# EAGLE design HumidityMetter_v2 (EAGLE 6.1)
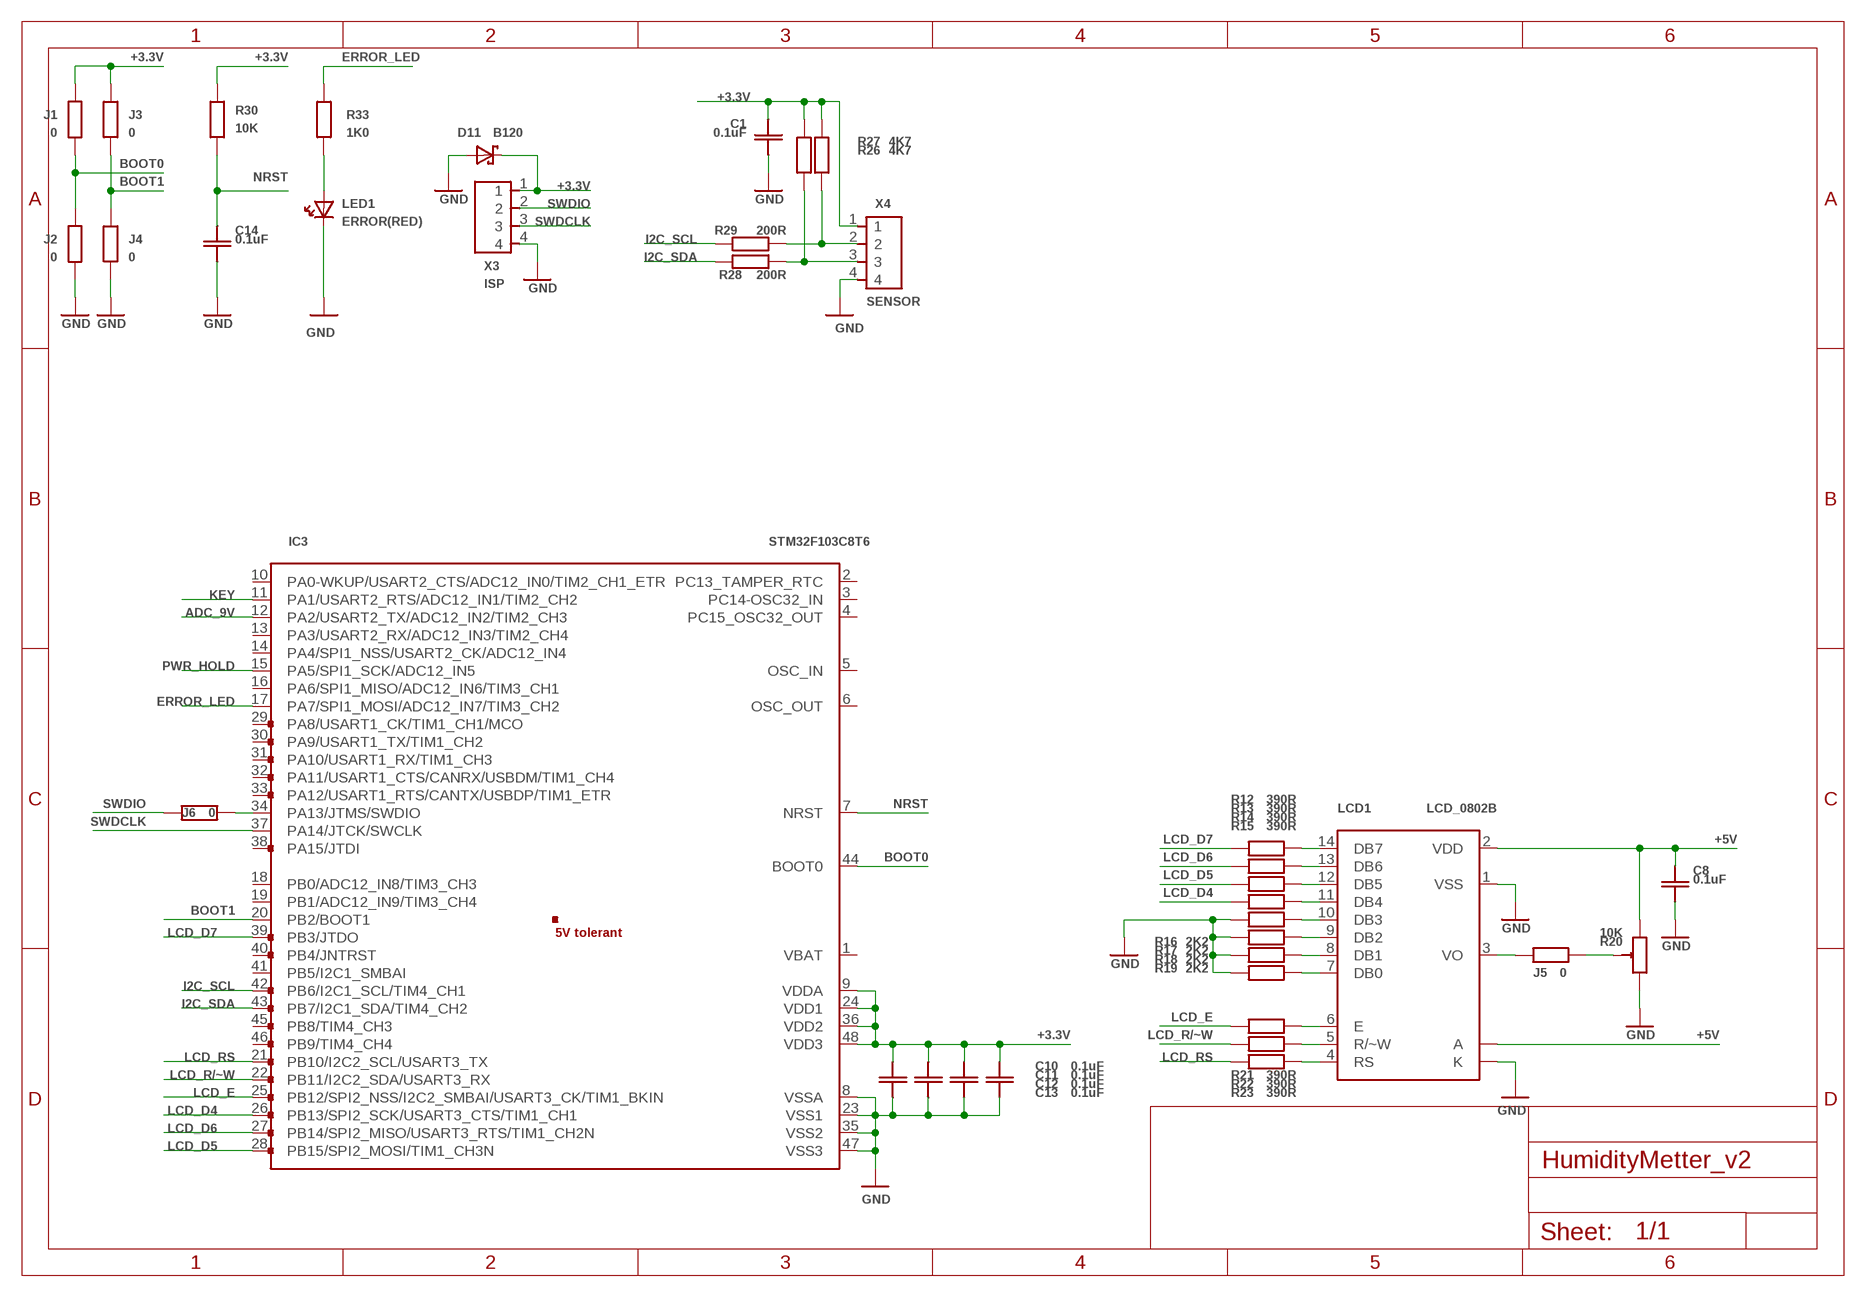
[diagram p0: schematic, sheet 1, part 1 of 2]
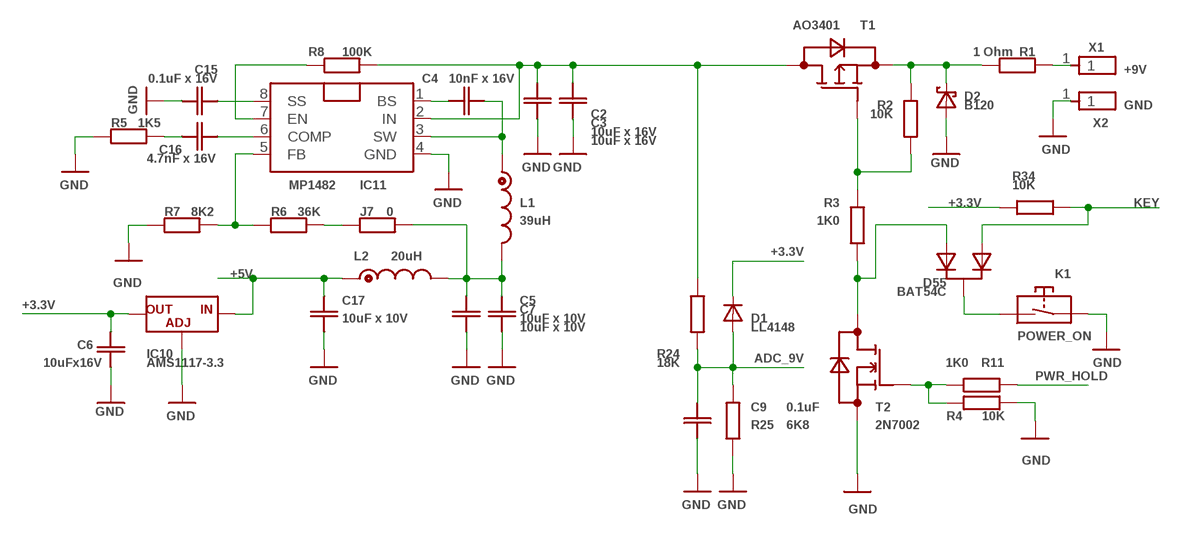
[diagram p1: schematic, sheet 1, part 2 of 2]

## Parts
C1  0.1uF  CSMD_0603  [RSMD_0603]
C2  10uF x 16V  CSMD_1206  [RSMD_1206]
C3  10uF x 16V  CSMD_1206  [RSMD_1206]
C4  10nF x 16V  CSMD_0603  [RSMD_0603]
C5  10uF x 10V  CSMD_1206  [RSMD_1206]
C6  10uFx16V  CSMD_1206  [RSMD_1206]
C7  10uF x 10V  CSMD_1206  [RSMD_1206]
C8  0.1uF  CSMD_0603  [RSMD_0603]
C9  0.1uF  CSMD_0603  [RSMD_0603]
C10  0.1uF  CSMD_0603  [RSMD_0603]
C11  0.1uF  CSMD_0603  [RSMD_0603]
C12  0.1uF  CSMD_0603  [RSMD_0603]
C13  0.1uF  CSMD_0603  [RSMD_0603]
C14  0.1uF  CSMD_0603  [RSMD_0603]
C15  0.1uF x 16V  CSMD_0603  [RSMD_0603]
C16  4.7nF x 16V  CSMD_0603  [RSMD_0603]
C17  10uF x 10V  CSMD_1206  [RSMD_1206]
D1  LL4148  LL4147SOD-80  [SOD-80]
D2  B120  B120(DO-214AC)  [DO-214AC]
D11  B120  B120(DO-214AC)  [DO-214AC]
D55  BAT54C  BAT54C(SOT23)  [SOT23_SMALL_PADS]
IC3  STM32F103C8T6  STM32F103C8T6(LQFP48)(LQFP48)  [LQFP48]
IC10  AMS1117-3.3  AMS1117SOT223_WS  [SOT223(WAVE_SOLDERING)]
IC11  MP1482  MP1482(SO-8)  [SOIC8]
J1  0  RSMD_0603  [RSMD_0603]
J2  0  RSMD_0603  [RSMD_0603]
J3  0  RSMD_0603  [RSMD_0603]
J4  0  RSMD_0603  [RSMD_0603]
J5  0  RSMD_1206_BIG_GAP  [RSMD_1206_BIG_GAP]
J6  0  RSMD_0805  [RSMD_0805]
J7  0  RSMD_1206_BIG_GAP  [RSMD_1206_BIG_GAP]
K1  POWER_ON  KEY(7X4.5)  [KEY_7X4.5]
L1  39uH  L(7MM)  [COIL_7MM]
L2  20uH  L(1206)  [RSMD_1206]
LCD1  LCD_0802B  LCD_0802BLCD_0802B_2SCREW(CHINA_CLONE)  [LCD_0802B_2SCREW(CHINA_CLONE)]
LED1  ERROR(RED)  LED3MM(SMD0805)  [LED_0805]
R1  1 Ohm  RSMD_1206  [RSMD_1206]
R2  10K  RSMD_0603  [RSMD_0603]
R3  1K0  RSMD_0603  [RSMD_0603]
R4  10K  RSMD_0603  [RSMD_0603]
R5  1K5  RSMD_0603  [RSMD_0603]
R6  36K  RSMD_0603  [RSMD_0603]
R7  8K2  RSMD_0603  [RSMD_0603]
R8  100K  RSMD_0603  [RSMD_0603]
R11  1K0  RSMD_0603  [RSMD_0603]
R12  390R  RSMD_0805  [RSMD_0805]
R13  390R  RSMD_0603  [RSMD_0603]
R14  390R  RSMD_0603  [RSMD_0603]
R15  390R  RSMD_0603  [RSMD_0603]
R16  2K2  RSMD_0603  [RSMD_0603]
R17  2K2  RSMD_0603  [RSMD_0603]
R18  2K2  RSMD_0603  [RSMD_0603]
R19  2K2  RSMD_0603  [RSMD_0603]
R20  10K  R_ADJHOR_7X7MM  [R_ADJ_HOR]
R21  390R  RSMD_0603  [RSMD_0603]
R22  390R  RSMD_0603  [RSMD_0603]
R23  390R  RSMD_0603  [RSMD_0603]
R24  18K  RSMD_0603  [RSMD_0603]
R25  6K8  RSMD_0603  [RSMD_0603]
R26  4K7  RSMD_0603  [RSMD_0603]
R27  4K7  RSMD_0603  [RSMD_0603]
R28  200R  RSMD_0603  [RSMD_0603]
R29  200R  RSMD_0603  [RSMD_0603]
R30  10K  RSMD_0603  [RSMD_0603]
R33  1K0  RSMD_0603  [RSMD_0603]
R34  10K  RSMD_0603  [RSMD_0603]
T1  AO3401  BSS84(SOT23)  [SOT23]
T2  2N7002  2N7002SOT23_SMALL_PADS  [SOT23_SMALL_PADS]
X1  +9V  PIN1X13.5MM_PWR  [PIN1X1_3.5MM_PWR]
X2  GND  PIN1X13.5MM_PWR  [PIN1X1_3.5MM_PWR]
X3  ISP  PIN4X1(2.54MM)  [PIN4X1_2.54MM]
X4  SENSOR  PIN4X1(JST_XH2.5)  [JST_XH2.5MM_4PIN]

## Nets
+3.3V: C1.PAD_1(PIN1) C6.PAD_1(PIN1) C10.PAD_1(PIN1) C11.PAD_1(PIN1) C12.PAD_1(PIN1) C13.PAD_1(PIN1) D1.CATHODE D11.CATHODE IC3.9(VDDA) IC3.24(VDD1) IC3.36(VDD2) IC3.48(VDD3) IC10.2(OUT) IC10.4(OUT) J1.PAD_0(PIN0) J3.PAD_0(PIN0) R26.PAD_0(PIN0) R27.PAD_0(PIN0) R30.PAD_0(PIN0) R34.PAD_0(PIN0) X3.1 X4.1
+5V: C8.PAD_1(PIN1) C17.PAD_1(PIN1) IC10.3(IN) L2.PAD_1(START) LCD1.2(VDD) LCD1.A R20.1(END_A)
ADC_9V: C9.PAD_1(PIN1) D1.ANODE IC3.12(PA2/USART2_TX/ADC12_IN2/TIM2_CH3) R24.PAD_1(PIN1) R25.PAD_0(PIN0)
BOOT0: IC3.44(BOOT0) J1.PAD_1(PIN1) J2.PAD_0(PIN0)
BOOT1: IC3.20(PB2/BOOT1) J3.PAD_1(PIN1) J4.PAD_0(PIN0)
ERROR_LED: IC3.17(PA7/SPI1_MOSI/ADC12_IN7/TIM3_CH2) R33.PAD_0(PIN0)
GND: C1.PAD_0(PIN0) C2.PAD_0(PIN0) C3.PAD_0(PIN0) C5.PAD_0(PIN0) C6.PAD_0(PIN0) C7.PAD_0(PIN0) C8.PAD_0(PIN0) C9.PAD_0(PIN0) C10.PAD_0(PIN0) C11.PAD_0(PIN0) C12.PAD_0(PIN0) C13.PAD_0(PIN0) C14.PAD_0(PIN0) C15.PAD_0(PIN0) C17.PAD_0(PIN0) D2.ANODE D11.ANODE IC3.8(VSSA) IC3.23(VSS1) IC3.35(VSS2) IC3.47(VSS3) IC10.1(ADJ) IC11.4(GND) J2.PAD_1(PIN1) J4.PAD_1(PIN1) K1.1 K1.2 LCD1.1(VSS) LCD1.K LED1.CATHODE R4.PAD_1(PIN1) R5.PAD_1(PIN1) R7.PAD_1(PIN1) R16.PAD_1(PIN1) R17.PAD_1(PIN1) R18.PAD_1(PIN1) R19.PAD_1(PIN1) R20.3(END_B) R25.PAD_1(PIN1) T2.2(SOURCE) X2.1 X3.4 X4.4
I2C_SCL: IC3.42(PB6/I2C1_SCL/TIM4_CH1) R29.PAD_0(PIN0)
I2C_SDA: IC3.43(PB7/I2C1_SDA/TIM4_CH2) R28.PAD_0(PIN0)
KEY: D55.2(ANODE2) IC3.11(PA1/USART2_RTS/ADC12_IN1/TIM2_CH2) R34.PAD_1(PIN1)
LCD_D4: IC3.26(PB13/SPI2_SCK/USART3_CTS/TIM1_CH1) R15.PAD_1(PIN1)
LCD_D5: IC3.28(PB15/SPI2_MOSI/TIM1_CH3N) R14.PAD_1(PIN1)
LCD_D6: IC3.27(PB14/SPI2_MISO/USART3_RTS/TIM1_CH2N) R13.PAD_1(PIN1)
LCD_D7: IC3.39(PB3/JTDO) R12.PAD_1(PIN1)
LCD_E: IC3.25(PB12/SPI2_NSS/I2C2_SMBAI/USART3_CK/TIM1_BKIN) R21.PAD_1(PIN1)
LCD_R/~W: IC3.22(PB11/I2C2_SDA/USART3_RX) R22.PAD_1(PIN1)
LCD_RS: IC3.21(PB10/I2C2_SCL/USART3_TX) R23.PAD_1(PIN1)
N$1: R1.PAD_1(PIN1) X1.1
N$2: D55.3(CATHODE) K1.3 K1.4
N$3: R2.PAD_1(PIN1) R3.PAD_0(PIN0) T1.1(GATE)
N$4: J5.PAD_1(PIN1) LCD1.3(VO)
N$5: R4.PAD_0(PIN0) R11.PAD_1(PIN1) T2.1(GATE)
N$6: IC3.34(PA13/JTMS/SWDIO) J6.PAD_0(PIN0)
N$7: D2.CATHODE R1.PAD_0(PIN0) R2.PAD_0(PIN0) T1.2(SOURCE)
N$8: C2.PAD_1(PIN1) C3.PAD_1(PIN1) IC11.2(IN) R8.PAD_1(PIN1) R24.PAD_0(PIN0) T1.3(DRAIN)
N$9: J5.PAD_0(PIN0) R20.2(ADJ)
N$10: LCD1.14(DB7) R12.PAD_0(PIN0)
N$11: LCD1.13(DB6) R13.PAD_0(PIN0)
N$12: LCD1.12(DB5) R14.PAD_0(PIN0)
N$13: LCD1.11(DB4) R15.PAD_0(PIN0)
N$14: R26.PAD_1(PIN1) R29.PAD_1(PIN1) X4.2
N$15: LCD1.10(DB3) R16.PAD_0(PIN0)
N$16: LCD1.9(DB2) R17.PAD_0(PIN0)
N$17: LCD1.8(DB1) R18.PAD_0(PIN0)
N$18: LCD1.7(DB0) R19.PAD_0(PIN0)
N$19: LED1.ANODE R33.PAD_1(PIN1)
N$20: R27.PAD_1(PIN1) R28.PAD_1(PIN1) X4.3
N$21: LCD1.4(RS) R23.PAD_0(PIN0)
N$22: LCD1.5(R/~W) R22.PAD_0(PIN0)
N$23: LCD1.6(E) R21.PAD_0(PIN0)
N$24: J7.PAD_1(PIN1) R6.PAD_0(PIN0)
N$25: IC11.7(EN) R8.PAD_0(PIN0)
N$26: D55.1(ANODE1) R3.PAD_1(PIN1) T2.3(DRAIN)
N$27: C4.PAD_0(PIN0) IC11.3(SW) L1.1(START)
N$29: C4.PAD_1(PIN1) IC11.1(BS)
N$31: C5.PAD_1(PIN1) C7.PAD_1(PIN1) J7.PAD_0(PIN0) L1.2(END) L2.PAD_0(END)
N$32: C15.PAD_1(PIN1) IC11.8(SS)
N$34: C16.PAD_1(PIN1) IC11.6(COMP)
N$35: C16.PAD_0(PIN0) R5.PAD_0(PIN0)
N$36: IC11.5(FB) R6.PAD_1(PIN1) R7.PAD_0(PIN0)
NRST: C14.PAD_1(PIN1) IC3.7(NRST) R30.PAD_1(PIN1)
PWR_HOLD: IC3.15(PA5/SPI1_SCK/ADC12_IN5) R11.PAD_0(PIN0)
SWDCLK: IC3.37(PA14/JTCK/SWCLK) X3.3
SWDIO: J6.PAD_1(PIN1) X3.2
Unconnected: IC3.1(VBAT) IC3.2(PC13_TAMPER_RTC) IC3.3(PC14-OSC32_IN) IC3.4(PC15_OSC32_OUT) IC3.5(OSC_IN) IC3.6(OSC_OUT) IC3.10(PA0-WKUP/USART2_CTS/ADC12_IN0/TIM2_CH1_ETR) IC3.13(PA3/USART2_RX/ADC12_IN3/TIM2_CH4) IC3.14(PA4/SPI1_NSS/USART2_CK/ADC12_IN4) IC3.16(PA6/SPI1_MISO/ADC12_IN6/TIM3_CH1) IC3.18(PB0/ADC12_IN8/TIM3_CH3) IC3.19(PB1/ADC12_IN9/TIM3_CH4) IC3.29(PA8/USART1_CK/TIM1_CH1/MCO) IC3.30(PA9/USART1_TX/TIM1_CH2) IC3.31(PA10/USART1_RX/TIM1_CH3) IC3.32(PA11/USART1_CTS/CANRX/USBDM/TIM1_CH4) IC3.33(PA12/USART1_RTS/CANTX/USBDP/TIM1_ETR) IC3.38(PA15/JTDI) IC3.40(PB4/JNTRST) IC3.41(PB5/I2C1_SMBAI) IC3.45(PB8/TIM4_CH3) IC3.46(PB9/TIM4_CH4)

## Library data of the parts
C1-C17 = __MyCommonLib1:C
D1 = __MyCommonLib1:LL4147
D2 D11 = __MyCommonLib1:B120
D55 = __MyCommonLib1:BAT54C
IC3 = __MyCommonLib1:STM32F103C8T6(LQFP48)
IC10 = __MyCommonLib1:AMS1117
IC11 = __MyCommonLib1:MP1482
J1-J7 R1-R8 R11-R19 R21-R30 R33 R34 = __MyCommonLib1:R
K1 = __MyCommonLib1:KEY
L1 L2 = __MyCommonLib1:L
LCD1 = __MyCommonLib1:LCD_0802B
LED1 = __MyCommonLib1:LED3MM
R20 = __MyCommonLib1:R_ADJ
T1 = __MyCommonLib1:BSS84
T2 = __MyCommonLib1:2N7002
X1 X2 = __MyCommonLib1:PIN1X1
X3 X4 = __MyCommonLib1:PIN4X1

## Board
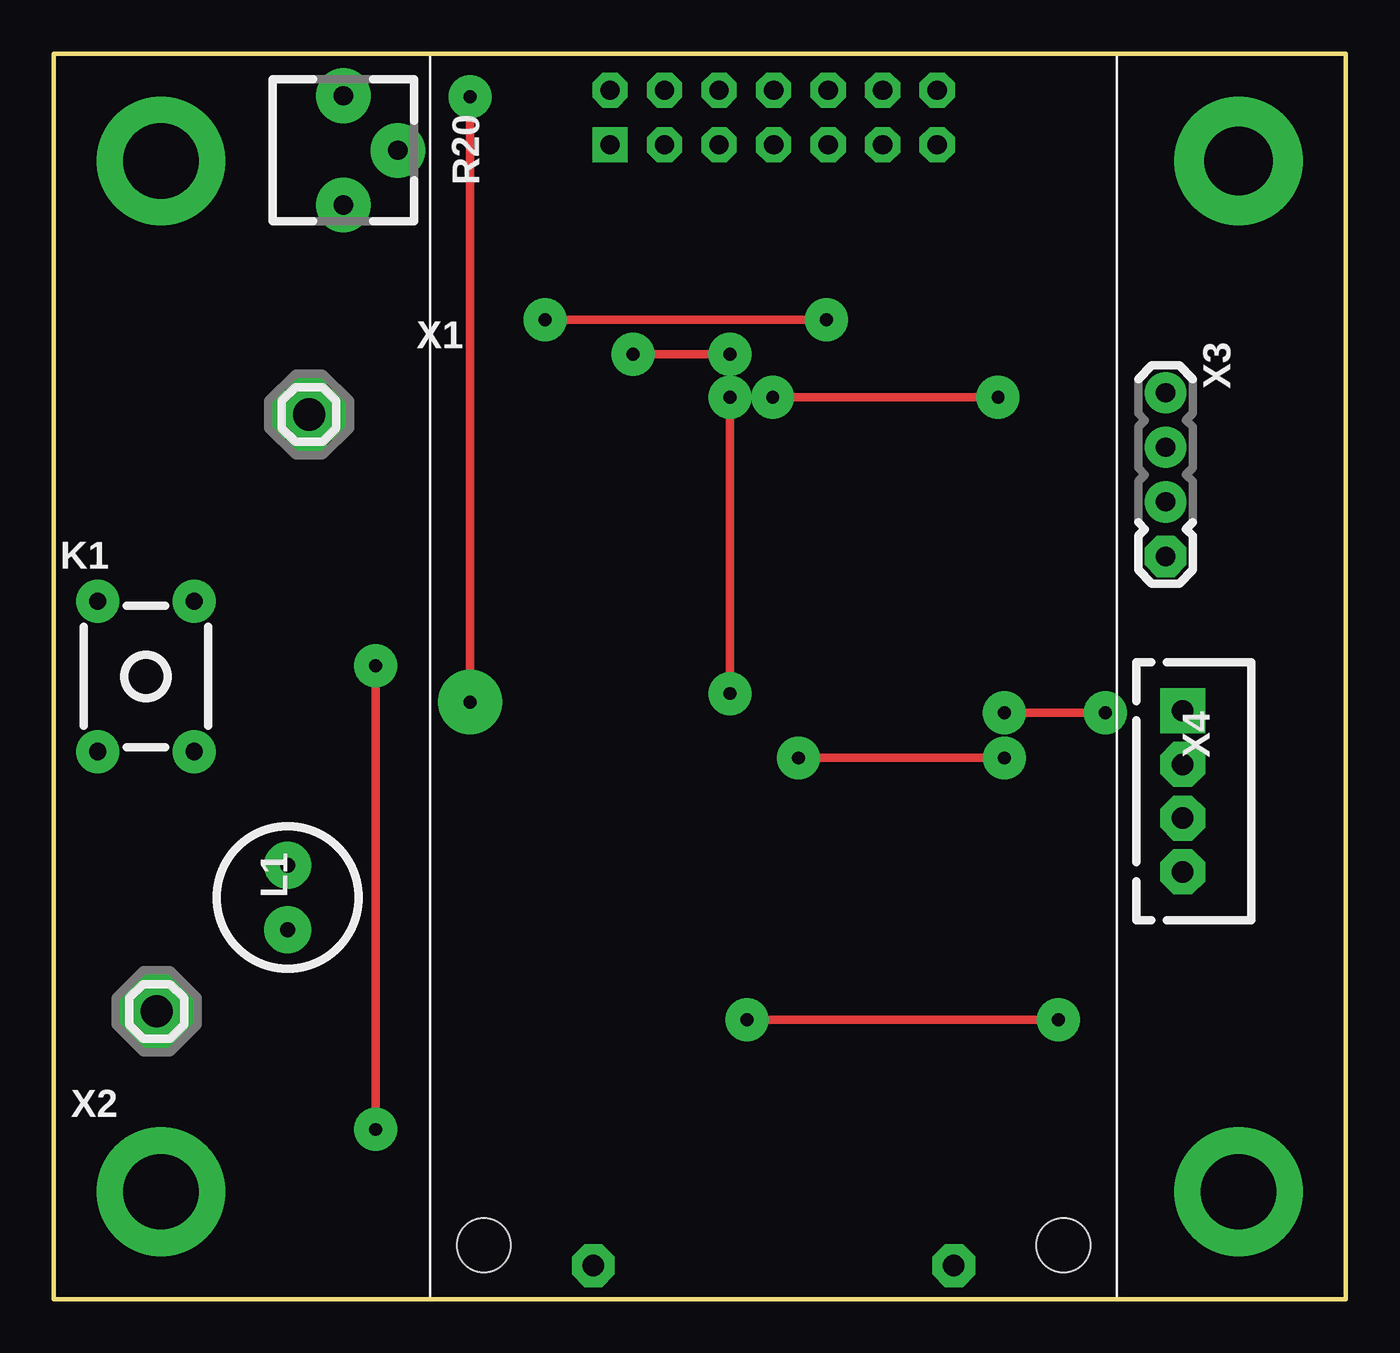
[diagram p2: board, top side]
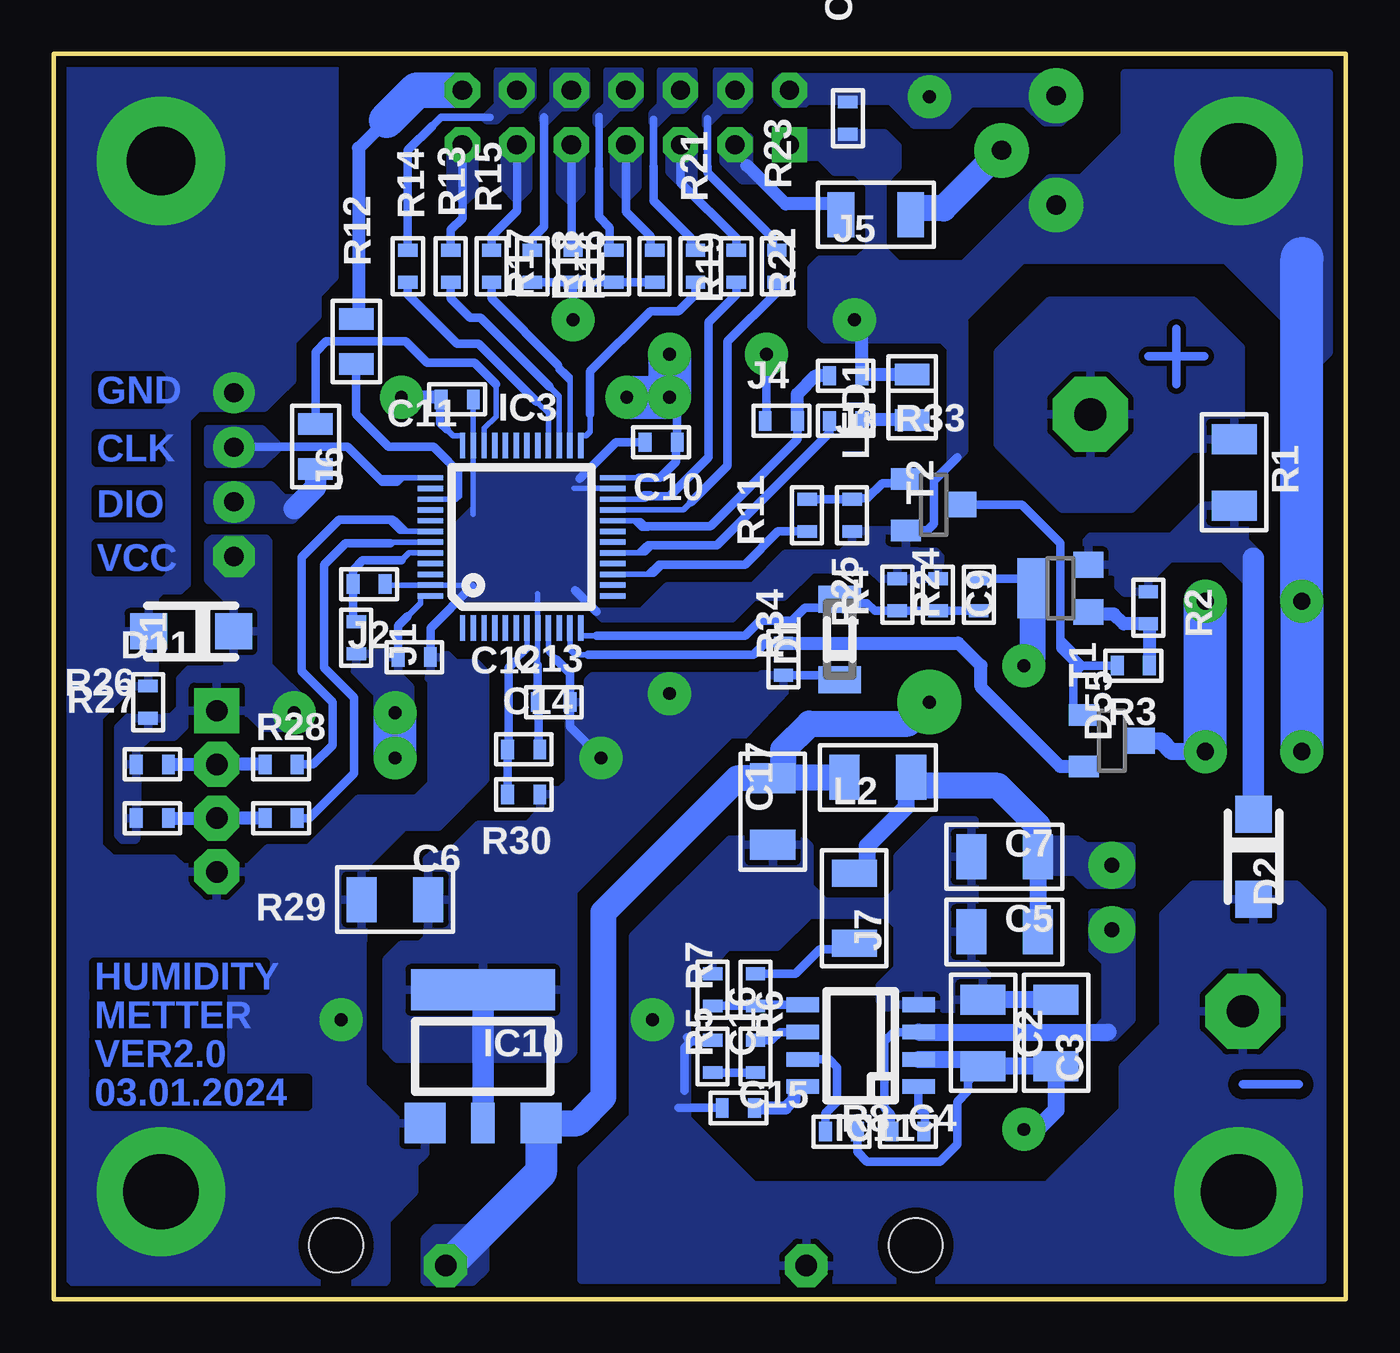
[diagram p3: board, bottom side, seen from below]

Size 60.2 x 58 mm. Coordinates in mm from the lower left corner, seen from the top.
Outline: 0,0 60.2,0 60.2,58 0,58 0,0
Copper layers (1*16): Top 0.035mm / dielectric 1.5mm / Bottom 0.035mm
Design rules: minimum track width 0.25mm, minimum drill 0.6mm, track to track 0.25mm, track to pad 0.25mm, pad to pad 0.25mm, via to via 0.25mm, smd to smd 0mil, copper to edge 0.5mm, drill to drill 0.5mm, minimum pad ring 10mil, minimum via ring 8mil, stop-mask expansion 0.2mm, vias tented up to drill 0mil, thermal gap 10mil

### Footprints (pad centres in the part's own frame; a part is rotated, then mirrored left to right if it is on the bottom)
RSMD_0603 = smd 0.6 x 0.9: PAD_0 -0.75,0; PAD_1 0.75,0
RSMD_1206 = smd 1.4 x 2.1: PAD_0 -1.55,0; PAD_1 1.55,0
SOD-80 = smd 1.25 x 2: ANODE 1.875,0; CATHODE -1.875,0
DO-214AC = smd 1.72 x 1.68: ANODE 1.98,0; CATHODE -1.98,0
SOT23_SMALL_PADS = smd 1 x 1.4: 1 1.2,1.3; 2 -1.2,1.3 | smd 1.2 x 1.4: 3 0,-1.3
LQFP48 = smd 0.25 x 1.2: 1 -2.75,-4.25; 2 -2.25,-4.25; 3 -1.75,-4.25; 4 -1.25,-4.25; 5 -0.75,-4.25; 6 -0.25,-4.25; 7 0.25,-4.25; 8 0.75,-4.25; 9 1.25,-4.25; 10 1.75,-4.25; 11 2.25,-4.25; 12 2.75,-4.25; 25 2.75,4.25; 26 2.25,4.25; 27 1.75,4.25; 28 1.25,4.25; 29 0.75,4.25; 30 0.25,4.25; 31 -0.25,4.25; 32 -0.75,4.25; 33 -1.25,4.25; 34 -1.75,4.25; 35 -2.25,4.25; 36 -2.75,4.25 | smd 1.2 x 0.25: 13 4.25,-2.75; 14 4.25,-2.25; 15 4.25,-1.75; 16 4.25,-1.25; 17 4.25,-0.75; 18 4.25,-0.25; 19 4.25,0.25; 20 4.25,0.75; 21 4.25,1.25; 22 4.25,1.75; 23 4.25,2.25; 24 4.25,2.75; 37 -4.25,2.75; 38 -4.25,2.25; 39 -4.25,1.75; 40 -4.25,1.25; 41 -4.25,0.75; 42 -4.25,0.25; 43 -4.25,-0.25; 44 -4.25,-0.75; 45 -4.25,-1.25; 46 -4.25,-1.75; 47 -4.25,-2.25; 48 -4.25,-2.75
SOT223(WAVE_SOLDERING) = smd 1.9 x 1.9: 1 -2.7,-3.1; 3 2.7,-3.1 | smd 1.1 x 1.9: 2 0,-3.1 | smd 6.7 x 1.9: 4 0,3.1
SOIC8 = smd 1.5 x 0.68: 1 -2.699,1.905; 2 -2.699,0.635; 3 -2.699,-0.635; 4 -2.699,-1.905; 5 2.699,-1.905; 6 2.699,-0.635; 7 2.699,0.635; 8 2.699,1.905
RSMD_1206_BIG_GAP = smd 1.25 x 2.1: PAD_0 -1.625,0; PAD_1 1.625,0
RSMD_0805 = smd 1 x 1.6: PAD_0 -1.05,0; PAD_1 1.05,0
KEY_7X4.5 = drill 0.8 pad 2: 1 -3.5,-2.25; 2 3.5,-2.25; 3 3.5,2.25; 4 -3.5,2.25
COIL_7MM = drill 0.7 pad 2.2: 1 -1.5,0; 2 1.5,0
LCD_0802B_2SCREW(CHINA_CLONE) = drill 0.9 pad 1.64 square: 1 4.24,8.38 | drill 0.9 pad 1.64 octagon: 2 1.7,8.38; 3 4.24,10.92; 4 1.7,10.92; 5 4.24,13.46; 6 1.7,13.46; 7 4.24,16; 8 1.7,16; 9 4.24,18.54; 10 1.7,18.54; 11 4.24,21.08; 12 1.7,21.08; 13 4.24,23.62; 14 1.7,23.62 | drill 1 pad 2 octagon: A 56.44,24.4; K 56.44,7.6 | hole 2.5: 55.5,29.5; 55.5,2.5
LED_0805 = smd 1 x 1.6: ANODE -1.05,0; CATHODE 1.05,0
R_ADJ_HOR = drill 0.9 pad 2.54: 1 -2.54,0; 2 0,2.54; 3 2.54,0
SOT23 = smd 1.2 x 1.4: 1 1.1,1.3; 2 -1.1,1.3 | smd 2.8 x 1.4: 3 0,-1.3
PIN1X1_3.5MM_PWR = drill 1.5 pad 3.5 octagon: 1 0,0
PIN4X1_2.54MM = drill 0.9 pad 1.93 octagon: 1 -3.81,0 | drill 0.9 pad 1.93: 2 -1.27,0; 3 1.27,0; 4 3.81,0
JST_XH2.5MM_4PIN = drill 1 pad 2.1 square: 1 0,0 | drill 1 pad 2.1 octagon: 2 2.5,0; 3 5,0; 4 7.5,0

### Placement (x,y rotation side)
C1  55.8,27.8 270 bottom
C2  16.9,12.4 270 bottom
C3  13.5,12.4 270 bottom
C4  20.4,7.8 0 bottom
C5  15.9,17.1 0 bottom
C6  44.3,18.6 0 bottom
C7  15.9,20.6 0 bottom
C8  23.2,55 90 bottom
C9  19,32.8 270 bottom
C10  31.9,39.9 0 bottom
C11  41.4,41.9 180 bottom
C12  43.4,29.9 180 bottom
C13  36.9,27.8 0 bottom
C14  38.3,25.6 180 bottom
C15  28.3,8.9 0 bottom
C16  27.5,11.3 90 bottom
C17  26.7,22.7 90 bottom
D1  23.58,30.72 90 bottom
D2  4.3,20.6 270 bottom
D11  53.8,31.1 180 bottom
D55  10.9,26 90 bottom
IC3  38.4,35.5 0 bottom
IC10  40.2,11.3 0 bottom
IC11  22.6,11.8 180 bottom
J1  46.1,30.8 90 bottom
J2  45.5,33.3 0 bottom
J3  26.3,40.9 0 bottom
J4  23.3,43 0 bottom
J5  21.9,50.5 180 bottom
J6  48,39.7 270 bottom
J7  22.9,18.2 270 bottom
K1  4.3,29 270 top
L1  10.9,18.7 90 top
L2  21.8,24.3 180 bottom
LCD1  17.54,58 270 top
LED1  20.2,42 90 bottom
R1  5.2,38.5 90 bottom
R2  9.2,32.2 270 bottom
R3  9.9,29.5 180 bottom
R4  23,36.5 270 bottom
R5  29.5,11.3 90 bottom
R6  27.5,14.4 270 bottom
R7  29.5,14.4 90 bottom
R8  23.5,7.8 0 bottom
R11  25.1,36.5 90 bottom
R12  46.1,44.6 270 bottom
R13  41.7,48.1 270 bottom
R14  43.7,48.1 270 bottom
R15  39.8,48.1 270 bottom
R16  37.9,48.1 270 bottom
R17  36,48.1 270 bottom
R18  34.1,48.1 270 bottom
R19  32.2,48.1 270 bottom
R20  13.5,53.5 270 top
R21  30.3,48.1 270 bottom
R22  28.4,48.1 270 bottom
R23  26.5,48.1 270 bottom
R24  17.1,32.8 270 bottom
R25  20.9,32.8 90 bottom
R26  55.6,24.9 0 bottom
R27  55.6,22.4 0 bottom
R28  49.6,22.4 180 bottom
R29  49.6,24.9 180 bottom
R30  38.3,23.5 180 bottom
R33  23.3,40.9 0 bottom
R34  26.2,29.8 90 bottom
T1  13.3,33.1 270 bottom
T2  19.2,37 90 bottom
X1  11.9,41.2 0 top
X2  4.8,13.4 0 top
X3  51.8,38.4 90 top
X4  52.6,27.4 270 top

### Tracks (layer width: path | path; a pad name or v marks a point on that pad's centre or on a via)
+3.3V  (via drill 0.6 pad 2)
  Top 0.4: v44.3,27.3 v49,27.3 | v44,42 v33.5,42 | v31.5,28.2 v31.5,42 | v34.7,25.2 v44.3,25.2 | v27,44 v31.5,44
  Bottom 0.25: IC3.24 32.95,38.25 | IC3.9 37.15,30.15 36.8,29.8 | IC3.48 43.1,32.75 43.1,32.4 43.7,31.8 | IC3.36 41.15,40.2 41.6,40.2 41.9,40.5
  Bottom 0.4: 32.95,38.25 31.95,38.25 31.2,39 31.2,39.85 C10.PAD_1 31.15,41.65 v31.5,42 | 36.8,29.8 36.15,29.15 C13.PAD_1 36.15,26.65 v34.7,25.2 | 43.7,31.8 44.15,31.35 C12.PAD_1 | D1.CATHODE 23.79,29.05 R34.PAD_0 | 41.9,40.5 42.2,40.8 42.2,41.9 | J3.PAD_0 27,40.95 v27,44
  Bottom 0.6: v44,42 42.25,42 C11.PAD_1 42.2,41.9
  Bottom 1: IC10.2 IC10.4
  Bottom 2: v33.5,42 v31.5,42 v31.5,44 | v44.3,25.2 v44.3,27.3
  pour Bottom: 56.3,25.7 56.3,21.5 56.4,21.4 57,21.4 57.2,21.6 57.2,26.6 56.7,27.1 54.7,27.1 54.3,27.5 54.3,28.9 53.9,29.3 52.3,29.3 52.1,29.5 52.1,32.6 53,33.5 53,34.6 50.2,34.6 50.2,29.5 48.3,27.6 48.3,26.9 48.6,26.6 50.4,26.6 51.1,27.3 53.8,27.3 54.1,27 54.1,26.7 54.6,26.2 55.8,26.2
  pour Bottom: 27.3,29 35.1,29 35.3,28.8 35.3,28 35.4,27.9 36.2,27.9 36.2,24.1 36.6,23.7 37.6,23.7 37.6,22.6 38.1,22.1 40.4,22.1 41.8,20.7 42.6,20.7 42.8,20.5 42.8,16.8 43.1,16.5 44,16.5 44.7,15.8 44.7,11.7 44.2,11.2 36.3,11.2 36,11.5 36,19 28.7,26.3 28,26.3 26.1,28.3 26.1,29.1 27.2,29.1
  pour Bottom: 43.6,27.2 43.6,28.5 44.1,29 44.1,30.1 46.2,30.1 46.2,29.3 45.1,28.2 45.1,27.2
  pour Bottom (no thermals): 50.2,33.1 50.2,35.3 50.3,35.4 52.8,35.4 53,35.2 53,33.5 52.6,33.1
+5V  (via drill 0.6 pad 2, 0.6 pad 3)
  Top 0.4: v19.4,56 v19.4,27.8
  Bottom 1.2: 26.2,24.3 L2.PAD_1 | v19.4,27.8 20.4,26.8 25,26.8 26.2,25.6 26.2,24.3 | IC10.3 35.8,8.2 34.6,9.4 34.6,18 28.35,24.25 C17.PAD_1 26.65,24.3 26.2,24.3
  Bottom 1.5: LCD1.A 41.84,1.56 37.5,5.9 IC10.3
  pour Bottom (no thermals): 13.3,54.8 14,54.8 14.9,55.7 17.5,55.7 18.5,54.7 20.1,54.7 21.2,55.8 25.1,55.8 25.2,55.7 26.3,55.7 26.5,55.9 26.5,56.7 26.3,56.9 12.9,56.9 12.9,55.2
  pour Bottom (no thermals): 40.1,3.2 40.1,1.4 40.7,0.8 42.9,0.8 42.9,2.8 42.4,3.3 40.1,3.3
ADC_9V
  Bottom 0.25: IC3.12 35.65,30.9 34.9,30.9
  Bottom 0.4: R24.PAD_1 C9.PAD_1 R25.PAD_0 21.95,32.05 22.3,32.4 23.39,32.4 D1.ANODE 23.98,32.2 25.2,32.2 25.8,31.6 27.3,31.6 28,30.9 34.9,30.9
BOOT0
  Bottom 0.25: IC3.44 43.65,34.75 44,34.4
  Bottom 0.4: 44,34.4 45.8,34.4 46.25,33.95 J2.PAD_0 46.25,31.7 J1.PAD_1
BOOT1
  Bottom 0.25: IC3.20 32.85,36.25 32.5,35.9 32.8,35.9 | 32.8,35.9 33.1,36.2 | 32.8,35.9 32.7,36
  Bottom 0.4: 32.7,36 29.6,36 25.55,40.05 J3.PAD_1
  Bottom 0.6: J4.PAD_0 24.7,43 25.55,42.15 J3.PAD_1
ERROR_LED
  Bottom 0.25: IC3.17 32.65,34.75 32.3,35.1 32.5,35.1 32.6,35.1 32.9,34.8
  Bottom 0.4: 32.5,35.1 29.3,35.1 24.05,40.35 R33.PAD_0
GND  (via drill 0.6 pad 2, 3.2 pad 6, 3.5 pad 6)
  Top 0.4: v36,45.6 v22.9,45.6 | v46.8,13 v32.3,13
  Bottom 0.25: J2.PAD_1 44.7,33.25 IC3.47 41.05,33.25 | IC3.23 35.95,37.75 | 40.65,36.55 IC3.35 C11.PAD_0 | 37.65,32.85 IC3.8 37.65,29.55
  Bottom 0.4: 30.8,9.7 30.8,11.7 30.5,12 | 30.5,12 29.55,12 R5.PAD_1 | 30.7,12.2 30.5,12 | R19.PAD_1 R18.PAD_1 R17.PAD_1 | R17.PAD_1 R16.PAD_1 | C12.PAD_0 42.65,31.25 40.7,33.2 | R17.PAD_1 v36,45.6 | C10.PAD_0 34,39.9 35.7,38.2 | 37.65,29.55 C13.PAD_0 37.6,27.8 37.6,25.65 C14.PAD_0 | C15.PAD_0 31.1,8.9 | T2.2 19.5,35.8 19.2,36.1 19.2,38.1 18.1,39.2 | 34.9,32 35.9,33
  Bottom 0.6: LED1.CATHODE 22.5,43.05 J4.PAD_1 22.55,45.25 v22.9,45.6
  Bottom 0.8: C3.PAD_0 C2.PAD_0
  Bottom 2: 2.05,48.45 K1.1 K1.2
  other vias: 55.2,5 55.2,53 5,5 5,53
  pour Bottom (isolate 0.5): 16.7,13.5 18.7,13.5 18.8,13.6 21.4,13.6 21.7,13.9 21.7,14.6 20.9,15.4 20.9,17.4 21.4,17.9 25,17.9 26.5,16.4 28.8,16.4 29.3,15.9 29.3,15.1 30.3,15.1 30.7,14.7 30.7,8.4 27.6,5.3 13.9,5.3 10.4,8.8 10.4,10.8 8.5,12.7 8.5,17.9 7.1,19.3 2.3,19.3 1.1,18.1 1.1,0.9 35.6,0.9 35.6,6.1 33.2,8.5 33.2,16.9 28.7,21.4 25.3,21.4 25,21.1 25,19.2 24.3,18.5 21.4,18.5 20.9,19 20.9,20.6 20.9,20.6 19.2,22.3 17.3,22.3 17.3,15.7 16.7,15.1
  pour Bottom: 35.5,38.4 35.5,32.6 41.3,32.6 41.3,36.1 40.6,36.8 40.6,38.4
  pour Bottom: 42.9,8.3 42.9,6.8 43.4,6.3 43.4,5 44.7,3.7 44.7,0.9 44.9,0.7 59.2,0.7 59.5,1 59.5,57.3 47.1,57.3 47.1,47.6 47.9,46.8 47.9,45.8 49.1,44.6 49.1,42.8 49.8,42.1 54,42.1 54,33.3 54.3,33 55.2,33 55.5,32.7 55.5,29.3 55.6,29.2 55.6,28.5 56.7,28.5 58.1,27.1 58.1,21.1 57.5,20.5 54.6,20.5 54.2,20.1 51.1,20.1 50.2,21 48.3,21 46,23.3 43.3,23.3 42.6,24 42.6,28.8 42.7,28.9 42.7,30 41.9,30 41.5,29.6 40.5,29.6 40.1,29.2 40.1,24.2 42.3,22 43.9,22 45.7,20.2 45.7,19.9 45.8,16.3 45.8,9.9 44.2,8.3
  pour Bottom (no thermals): 26.5,53.2 24.5,53.2 23.8,52.5 22.8,52.5 22.2,51.9 22.2,48.9 22.7,48.4 24.5,48.4 24.9,48 24.9,45.3 24.3,44.7 18.8,44.7 18.4,44.3 18.4,38.9 17.8,39.5 17.8,45.7 15.1,48.4 5.6,48.4 1.4,44.2 1.4,43.5 0.8,44.1 0.8,57.1 10.3,57.1 10.3,54.2 12.3,52.2 13.8,52.2 17.8,48.2 20.9,48.2 21.6,48.9 21.6,52 20.9,52.7 20.9,53.7 21.5,54.3 26.5,54.3
  pour Bottom: 18.9,33.5 21.6,33.5 22.1,34 24.9,34 26.2,32.7 27.6,32.7 28.6,31.7 34.6,31.7 34.9,32 32.8,32 31.6,33.2 27.6,33.2 26.1,34.7 23.5,34.7 23.1,35.1 23.1,35.8 20.2,35.8 20.2,35 20,34.8 19.1,34.8 18.9,34.6
  pour Bottom (no thermals): 49.8,42.1 50.4,41.5 53.5,41.5 54,41 54,43.6 49.8,43.6
I2C_SCL
  Bottom 0.25: 44.6,36.3 44.05,35.75 43.75,35.75 | 44.4,36.3 44.3,36.3 43.75,35.75 | 43.75,35.75 IC3.42
  Bottom 0.4: R29.PAD_0 48.1,24.9 47.2,25.8 47.2,27.8 48.65,29.25 48.65,34.55 46.9,36.3 44.6,36.3 44.4,36.3
I2C_SDA
  Bottom 0.25: IC3.43 44.45,35.25 44.5,35.2
  Bottom 0.4: R28.PAD_0 48.3,22.4 46.2,24.5 46.2,28 47.6,29.4 47.6,34.2 46.6,35.2 44.5,35.2
KEY
  Bottom 0.25: IC3.11 36.15,30.25 35.9,30 35.3,30
  Bottom 0.4: 35.3,30 27.6,30 27.05,30.55 R34.PAD_1
  Bottom 0.6: D55.2 13.3,24.8 17,28.5 17,29.5 18.05,30.55 R34.PAD_1
LCD_D4
  Bottom 0.25: IC3.26 36.15,42.95 36.7,43.5 36.7,43.3 36.2,42.8
  Bottom 0.4: R15.PAD_1 39.8,46.6 36.7,43.5
LCD_D5
  Bottom 0.25: IC3.28 37.15,41.25 37.7,41.8
  Bottom 0.4: R14.PAD_1 43.7,46.8 41.4,44.5 40.4,44.5 37.7,41.8
LCD_D6
  Bottom 0.25: IC3.27 36.65,42.05 37.1,42.5
  Bottom 0.4: 37.1,42.5 40.3,45.7 40.8,45.7 41.7,46.6 R13.PAD_1
LCD_D7
  Bottom 0.25: IC3.39 41.45,37.25 41.3,37.4 41.3,38.6 41.8,39.1 41.8,39 41.8,38.9 41.4,38.5 41.4,37.6 41.7,37.3
  Bottom 0.4: 41.8,39 42.5,39.7 44.6,39.7 46.1,41.2 R12.PAD_1
LCD_E
  Bottom 0.25: IC3.25 35.65,40.2 35.4,40.2 35.2,40.4 35.2,41.2
  Bottom 0.4: R21.PAD_1 30.3,46.8 31.1,46 32.4,46 35.2,43.2 35.2,41.2
LCD_R/~W
  Bottom 0.25: IC3.22 32.65,37.25 32.4,37.5 32.7,37.5 | 32.7,37.5 32.9,37.3 | 32.7,37.4 32.7,37.5
  Bottom 0.4: R22.PAD_1 28.4,46.8 29.7,45.5 29.7,39.2 31.5,37.4 32.7,37.4
LCD_RS
  Bottom 0.25: IC3.21 30.85,36.75 30.5,37.1
  Bottom 0.4: R23.PAD_1 26.5,46.9 28.8,44.6 28.8,38.8 30.5,37.1
MINUS_SIGN
  Bottom 0.4: 2.2,10 4.8,10
N$1
  pour Bottom: 4.9,39.6 7.2,39.6 10,36.8 13.2,36.8 16.2,39.8 16.2,44.1 13.8,46.5 7.1,46.5 4.9,44.3
N$2
  Bottom 0.8: D55.3 8.6,26 8.1,25.5 K1.3
  Bottom 2: K1.3 K1.4
N$3
  Bottom 0.6: R3.PAD_0 9.15,31.4 R2.PAD_1 10.35,31.45 10.8,31.9 11.9,31.9 T1.1
N$4
  Bottom 0.6: J5.PAD_1 24.02,51 26.1,51 27.9,52.8
  pour Bottom (no thermals): 27.8,54.1 27.8,52.8 27.3,52.3 27.1,52.1 28.1,52.1 28.9,52.9 29,53 29,54.1
N$5
  Bottom 0.4: T2.1 20.7,38 21.6,38 22.3,37.3 22.9,37.3 22.95,37.25 R4.PAD_0 R11.PAD_1
N$6
  Bottom 0.25: IC3.34 40.15,40.55 39.6,41.1 39.6,42.6
  Bottom 0.4: J6.PAD_0 48,44.1 47.5,44.6 43.8,44.6 42.8,43.6 40.6,43.6 39.6,42.6
N$7
  Bottom 1: D2.CATHODE 4.3,34.5
  pour Bottom: 4.7,37.2 4.7,35.3 4,34.6 4,33.4 4.6,33.4 5.7,34.5 8.2,34.5 9.1,33.6 9.1,32.9 10.3,32.9 10.6,33.2 10.6,33.7 10.8,33.9 12.1,33.9 12.1,35.3 11.9,35.5 8.1,35.5 6.4,37.2
N$8  (via drill 0.6 pad 2)
  Top 0.4: v15,29.5 v15,7.9
  Bottom 0.4: R8.PAD_1 22.75,6.85 22.3,6.4 18.9,6.4 18.1,7.2 18.1,9.2 17.6,9.7 17.6,10.15 C2.PAD_1 | R24.PAD_0 15.05,33.55 T1.3
  Bottom 0.6: 14.7,32.1 14.6,32.2
  Bottom 0.8: IC11.2 17.21,11.16 C2.PAD_1 C3.PAD_1 13.5,8.8 14.4,7.9 v15,7.9
  Bottom 1.2: T1.3 14.6,32.2 14.6,29.9 v15,29.5
N$9
  Bottom 1.2: R20.2 18.74,50.8 20.1,50.8 20.1,50.67 J5.PAD_0
N$10
  Bottom 0.6: 44.7,54.9 46,53.6 46,45.75 R12.PAD_0
  Bottom 1.65: LCD1.14 43.3,56.3 44.7,54.9
N$11
  Bottom 0.4: LCD1.13 41.16,50.34 41.7,49.8 R13.PAD_0
  pour Bottom (no thermals): 40.6,53.8 40.6,51.6 41.1,51.1 41.7,51.7 41.7,53.9 40.6,53.9
N$12
  Bottom 0.35: 39.87,55.05 42.15,55.05 42.55,54.65
  Bottom 0.4: R14.PAD_0 43.7,53.5 42.55,54.65
  pour Bottom (no thermals): 37.9,57.2 37.9,56 38.5,55.4 39.1,55.4 39.6,54.9 40,54.9 40.1,55 39.5,55.6 39.5,57.2
N$13
  Bottom 0.4: LCD1.11 38.62,50.68 39.8,49.5 R15.PAD_0
  pour Bottom (no thermals): 38.1,53.9 38.1,51.7 38.6,51.2 39.2,51.8 39.2,53.9
N$14
  Bottom 0.6: R29.PAD_1 X4.2 R26.PAD_1
N$15
  Bottom 0.4: R16.PAD_0 37.9,49.4 37.35,49.95 37.35,55.03
  pour Bottom (no thermals): 35.4,57.2 35.4,56 35.9,55.5 36.6,55.5 37.3,54.8 37.4,54.9 37.4,55.2 36.9,55.7 36.9,57.2
N$16
  Bottom 0.4: R17.PAD_0 36.08,48.93 LCD1.9
  pour Bottom (no thermals): 35.6,54 35.6,51.6 36.1,51.1 36.6,51.6 36.6,54
N$17
  Bottom 0.35: 34.8,55.09 34.8,52.65
  Bottom 0.4: 34.8,52.65 34.8,50.4 34.3,49.9 34.3,49.05 R18.PAD_0
  pour Bottom (no thermals): 32.9,57.2 32.9,55.9 33.3,55.5 33.9,55.5 34.7,54.7 34.8,54.7 34.9,54.8 34.9,55.1 34.4,55.6 34.4,57.2
N$18
  Bottom 0.4: LCD1.7 33.54,50.64 32.4,49.5 32.4,49.05 R19.PAD_0
  pour Bottom (no thermals): 33,54.1 33,51.8 33.5,51.3 34.1,51.9 34.1,54.1
N$19
  Bottom 0.6: LED1.ANODE 22.5,40.95 R33.PAD_1
N$20
  Bottom 0.6: R27.PAD_1 X4.3 R28.PAD_1
N$21
  Bottom 0.35: 29.75,54.96 29.75,52.75
  Bottom 0.4: 29.75,52.75 29.75,52.45 26.7,49.4 26.7,49.05 R23.PAD_0
  pour Bottom (no thermals): 27.8,57.2 27.8,55.8 28.2,55.4 29.1,55.4 29.8,54.7 29.8,55.1 29.3,55.6 29.3,57.2
N$22
  Bottom 0.4: R22.PAD_0 28.4,49.4 31,52 LCD1.5
  pour Bottom (no thermals): 30.4,54.1 30.4,51.4 31.5,52.5 31.5,53.4 31.5,54.1
N$23
  Bottom 0.35: 32.25,54.95 32.25,52.75
  Bottom 0.4: 32.25,52.75 32.25,51.15 30.5,49.4 30.5,49.05 R21.PAD_0
  pour Bottom (no thermals): 30.4,57.2 30.4,55.9 30.9,55.4 31.5,55.4 32.2,54.7 32.3,54.8 32.3,55.2 31.9,55.6 31.9,57.2
N$24
  Bottom 0.4: R6.PAD_0 25.65,15.15 24.5,16.3 23.18,16.3 J7.PAD_1
N$25
  Bottom 0.4: R8.PAD_0 24.25,8.65 23.7,9.2 23.7,10.8 24.07,11.16 IC11.7
N$26
  Bottom 0.4: T2.3 15.1,37 13.3,35.2 13.3,30.7 | 13.3,30.7 12.7,30.1 12.7,29.9 | 12.7,29.7 13.3,30.3 13.3,30.7 | D55.1 arc90 12.7,27.7 12.7,29.1 | 12.7,29.1 12.7,29.7 | 12.7,29.7 12.7,29.9 | 12.7,29.9 12.3,29.5 | 12.3,29.5 12.7,29.1 | R3.PAD_1 12.3,29.5
N$27
  Bottom 0.4: IC11.3 21.07,12.44 21.5,12 21.5,8.9 21.2,8.6 21.2,7.85 C4.PAD_0
  Bottom 0.8: IC11.3 11.06,12.44
  pour Bottom (no thermals): 11.8,18 10,18 10,13 10.8,12.2 11.4,12.2 11.6,12.4 11.6,12.6 11.2,13 11.2,15.7 11.8,16.3
N$29
  Bottom 0.4: IC11.1 19.9,8.9 19.6,8.6 19.6,7.85 C4.PAD_1
N$31
  Bottom 0.8: C7.PAD_1 C5.PAD_1 | L2.PAD_0 20.5,24.05 20.5,22.9 22.3,21.1 22.3,19.82 J7.PAD_0
  Bottom 1.2: C7.PAD_1 14.35,22.05 16.2,23.9 19.9,23.9 20.25,24.25 L2.PAD_0
  pour Bottom (no thermals): 10,19.3 12,19.3 12.6,19.9 14.6,19.9 14.6,21.4 12.5,21.4 12.1,21.1 10,21.1
N$32
  Bottom 0.6: IC11.8 25.7,9.89 25.7,9.9 25.7,9.3 26.1,8.9 C15.PAD_1
N$34
  Bottom 0.4: IC11.6 26.36,12.44 26.75,12.05 C16.PAD_1
N$35
  Bottom 0.4: C16.PAD_0 R5.PAD_0
N$36
  Bottom 0.4: IC11.5 27.45,13.71 R6.PAD_1 R7.PAD_0
NRST
  Bottom 0.25: IC3.7 38.15,30.25 38.7,29.7
  Bottom 0.4: 38.7,29.7 39,29.4 39,25.65 C14.PAD_1 R30.PAD_1
PLUS_SIGN
  Bottom 0.4: 7.9,42.6 7.9,43.9 | 7.9,43.9 7.9,45.2 | 6.6,43.9 7.9,43.9 | 9.2,43.9 7.9,43.9
PWR_HOLD
  Bottom 0.25: IC3.15 32.25,33.75 31.8,34.2 32,34.2 32.1,34.2 32.5,33.8
  Bottom 0.4: R11.PAD_0 26.45,35.75 28,34.2 32,34.2
SWDCLK
  Bottom 0.25: 43.95,38.25 44.2,38 44.9,38 45.15,38.25 45.05,38.25 43.95,38.25 | IC3.37 43.95,38.25
  Bottom 0.4: 45.05,38.25 46.5,39.7 51.77,39.7 X3.3
  pour Bottom (no thermals): 49.7,39.7 50.5,38.9 53,38.9 53,40.5 50.5,40.5
SWDIO
  Bottom 1: J6.PAD_1 48,37.8 49,36.8
  pour Bottom (no thermals): 50.1,37.9 53,37.9 53,36.3 49.1,36.3 48.5,36.9 48.9,37.3 49.5,37.3

### Text on the board
Bottom: GND | CLK | DIO | VCC | HUMIDITY | METTER | VER2.0 | 03.01.2024